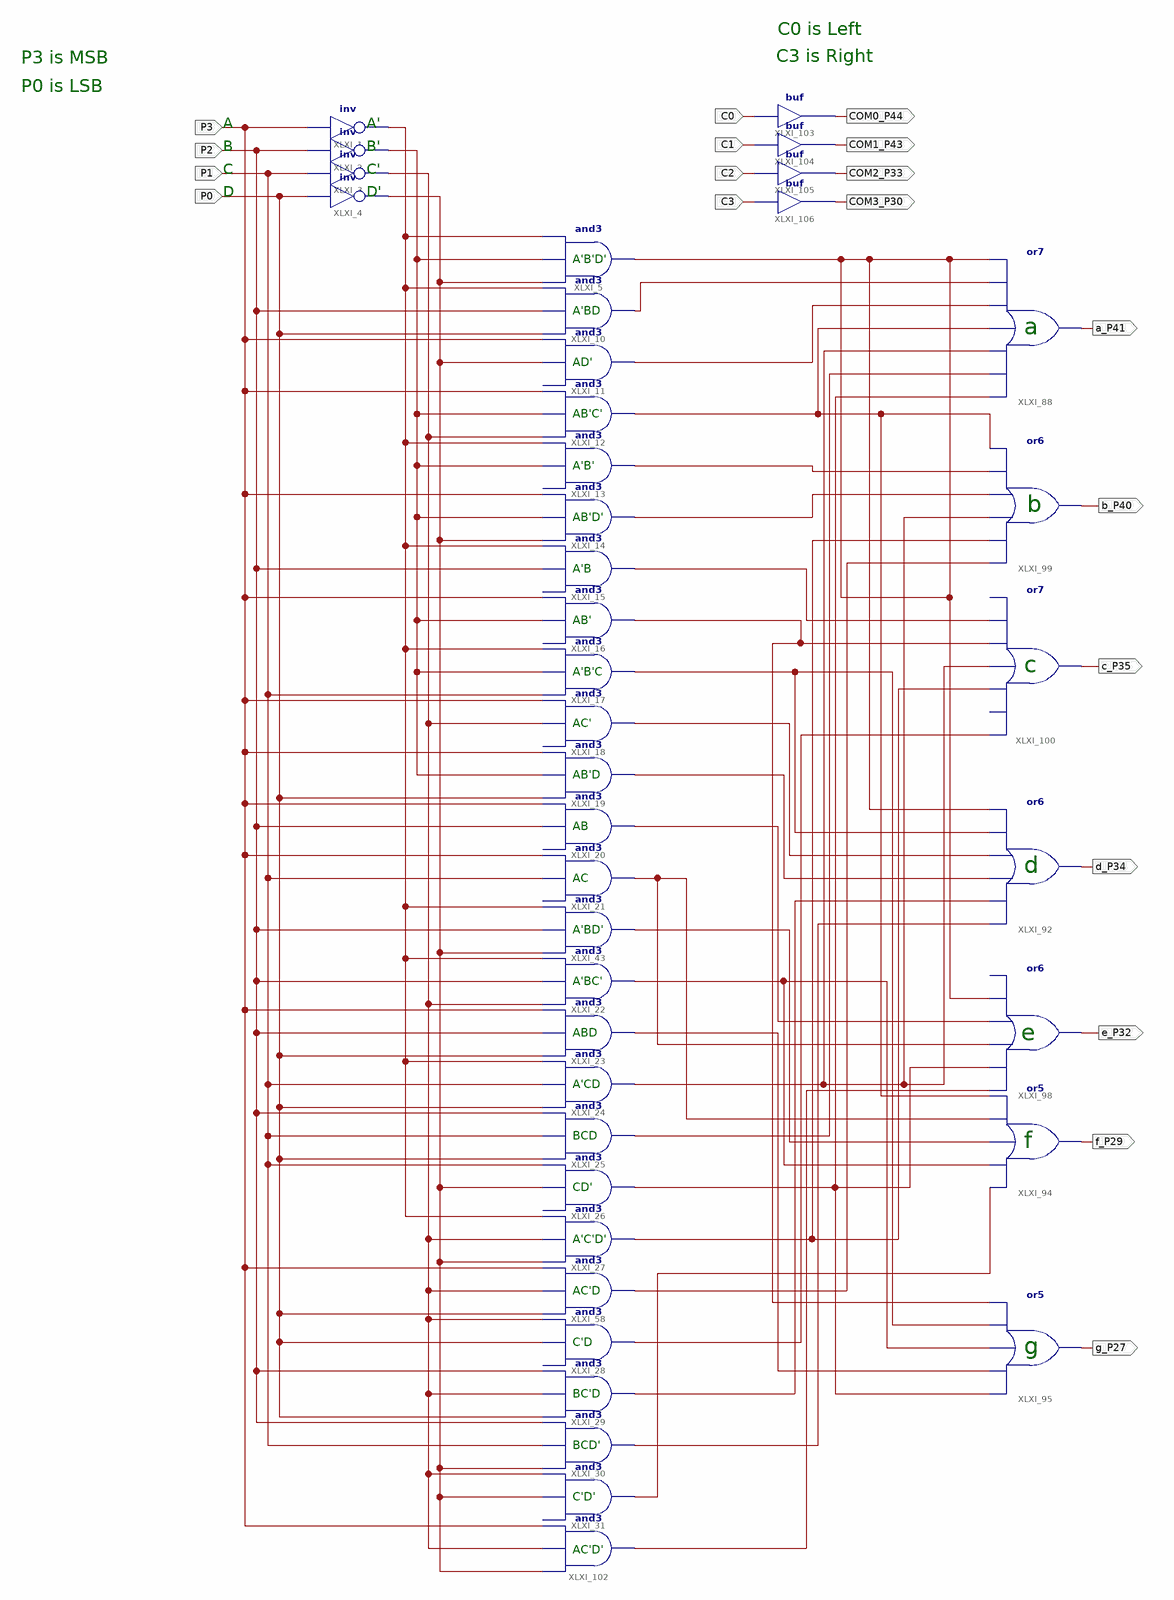
[diagram p0: schematic sheet 1]
// Xilinx ISE schematic sseg.sch (spartan6) as structural Verilog: 41 symbols, 19 ports
module sseg (
  input  P1,
  input  P3,
  input  P2,
  input  P0,
  input  C0,
  input  C1,
  input  C2,
  input  C3,
  output a_P41,
  output b_P40,
  output c_P35,
  output d_P34,
  output e_P32,
  output f_P29,
  output g_P27,
  output COM0_P44,
  output COM1_P43,
  output COM2_P33,
  output COM3_P30
);

  wire XLXN_64, XLXN_75, XLXN_83, XLXN_92, XLXN_207, XLXN_208, XLXN_213, XLXN_214, XLXN_215, XLXN_220,
       XLXN_221, XLXN_222, XLXN_224, XLXN_225, XLXN_227, XLXN_229, XLXN_230, XLXN_231, XLXN_232, XLXN_233,
       XLXN_234, XLXN_235, XLXN_236, XLXN_237, XLXN_238, XLXN_239, XLXN_240, XLXN_247, XLXN_250, XLXN_254;

  not XLXI_1 (XLXN_64, P3);
  not XLXI_2 (XLXN_75, P2);
  not XLXI_3 (XLXN_83, P1);
  not XLXI_4 (XLXN_92, P0);
  and XLXI_5 (XLXN_247, XLXN_92, XLXN_75, XLXN_64);
  and XLXI_10 (XLXN_207, P0, P2, XLXN_64);
  and XLXI_11 (XLXN_208, XLXN_92, P3);  // open: I0
  and XLXI_12 (XLXN_236, XLXN_83, XLXN_75, P3);
  and XLXI_13 (XLXN_220, XLXN_75, XLXN_64);  // open: I0
  and XLXI_14 (XLXN_221, XLXN_92, XLXN_75, P3);
  and XLXI_15 (XLXN_224, P2, XLXN_64);  // open: I0
  and XLXI_16 (XLXN_225, XLXN_75, P3);  // open: I0
  and XLXI_17 (XLXN_229, P1, XLXN_75, XLXN_64);
  and XLXI_18 (XLXN_230, XLXN_83, P3);  // open: I0
  and XLXI_19 (XLXN_231, P0, XLXN_75, P3);
  and XLXI_20 (XLXN_234, P2, P3);  // open: I0
  and XLXI_21 (XLXN_235, P1, P3);  // open: I0
  and XLXI_43 (XLXN_237, XLXN_92, P2, XLXN_64);
  and XLXI_23 (XLXN_240, P0, P2, P3);
  and XLXI_24 (XLXN_213, P0, P1, XLXN_64);
  and XLXI_25 (XLXN_214, P0, P1, P2);
  and XLXI_26 (XLXN_215, XLXN_92, P1);  // open: I0
  and XLXI_22 (XLXN_238, XLXN_83, P2, XLXN_64);
  and XLXI_28 (XLXN_227, P0, XLXN_83);  // open: I0
  and XLXI_29 (XLXN_232, P0, XLXN_83, P2);
  and XLXI_30 (XLXN_233, XLXN_92, P1, P2);
  and XLXI_31 (XLXN_239, XLXN_92, XLXN_83);  // open: I0
  and XLXI_27 (XLXN_222, XLXN_92, XLXN_83, XLXN_64);
  and XLXI_58 (XLXN_250, P0, XLXN_83, P3);
  or XLXI_92 (d_P34, XLXN_233, XLXN_232, XLXN_231, XLXN_230, XLXN_229, XLXN_247);
  or XLXI_94 (f_P29, XLXN_239, XLXN_238, XLXN_237, XLXN_235, XLXN_236);
  or XLXI_88 (a_P41, XLXN_215, XLXN_214, XLXN_213, XLXN_236, XLXN_208, XLXN_207, XLXN_247);
  or XLXI_95 (g_P27, XLXN_215, XLXN_240, XLXN_238, XLXN_229, XLXN_225);
  or XLXI_98 (e_P32, XLXN_254, XLXN_215, XLXN_235, XLXN_234, XLXN_247);  // open: I5
  or XLXI_99 (b_P40, XLXN_250, XLXN_222, XLXN_213, XLXN_221, XLXN_220, XLXN_236);
  or XLXI_100 (c_P35, XLXN_227, XLXN_222, XLXN_213, XLXN_225, XLXN_224);  // open: I1, I6
  and XLXI_102 (XLXN_254, XLXN_92, XLXN_83, P3);
  buf XLXI_103 (COM0_P44, C0);
  buf XLXI_104 (COM1_P43, C1);
  buf XLXI_105 (COM2_P33, C2);
  buf XLXI_106 (COM3_P30, C3);

  // Notes on the sheet:
  //   C0 is Left
  //   C3 is Right
  //   P3 is MSB
  //   P0 is LSB
  //   A
  //   A'
  //   B
  //   B'
  //   C
  //   C'
  //   D
  //   D'
  //   A'B'D'
  //   A'BD
  //   a
  //   AD'
  //   AB'C'
  //   A'B'
  //   b
  //   AB'D'
  //   A'B
  //   AB'
  //   c
  //   A'B'C
  //   AC'
  //   AB'D
  //   AB
  //   d
  //   AC
  //   A'BD'
  //   A'BC'
  //   ABD
  //   e
  //   A'CD
  //   BCD
  //   f
  //   CD'
  //   A'C'D'
  //   AC'D
  //   C'D
  //   g
  //   BC'D
  //   BCD'
  //   C'D'
  //   AC'D'
endmodule
